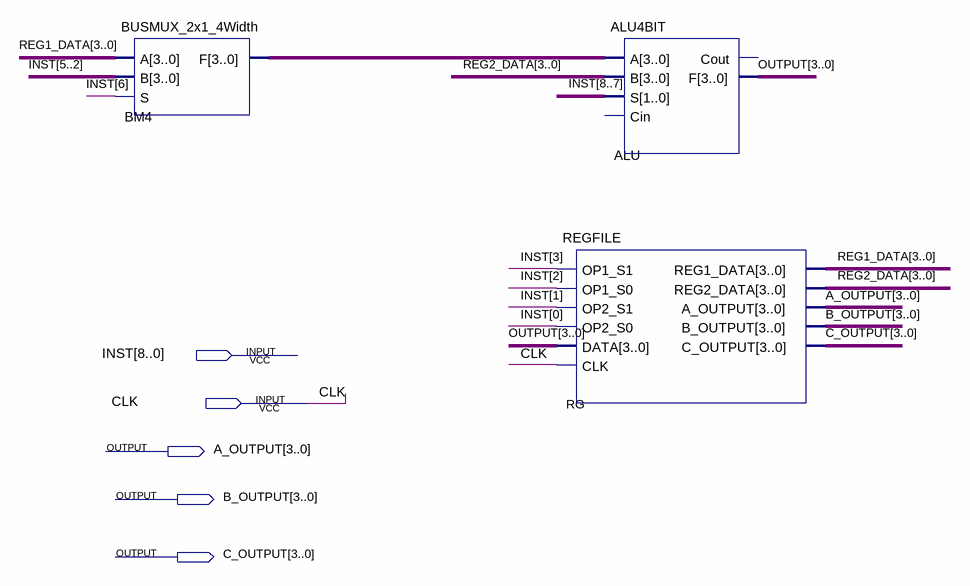
[diagram p0: schematic sheet]
// Quartus schematic Execution_Unit.bdf as structural Verilog: 3 symbols, 5 pins
module Execution_Unit (
  input  [8:0] INST,
  input  CLK,
  output [3:0] A_OUTPUT,
  output [3:0] B_OUTPUT,
  output [3:0] C_OUTPUT
);

  wire [3:0] BM4_f, OUTPUT, REG1_DATA, REG2_DATA;

  BUSMUX_2x1_4Width BM4 (.A(REG1_DATA), .B(INST[5:2]), .S(INST[6]), .F(BM4_f));
  REGFILE RG (
    .OP1_S1(INST[3]), .OP1_S0(INST[2]), .OP2_S1(INST[1]), .OP2_S0(INST[0]), .DATA(OUTPUT), .CLK(CLK),
    .REG1_DATA(REG1_DATA), .REG2_DATA(REG2_DATA), .A_OUTPUT(A_OUTPUT), .B_OUTPUT(B_OUTPUT),
    .C_OUTPUT(C_OUTPUT));
  ALU4BIT ALU (.A(BM4_f), .B(REG2_DATA), .S(INST[8:7]), .F(OUTPUT));  // open: Cin, Cout
endmodule
